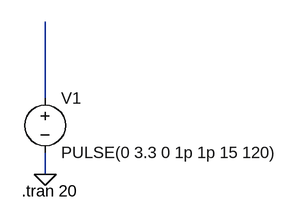
[diagram p0: schematic Draft2.asc]
Draft2.asc, the LTspice schematic file:
Version 4
SHEET 1 880 680
WIRE -192 112 -192 0
WIRE -192 224 -192 192
FLAG -192 224 0
SYMBOL voltage -192 96 R0
WINDOW 123 0 0 Left 0
WINDOW 39 0 0 Left 0
SYMATTR InstName V1
SYMATTR Value PULSE(0 3.3 0 1p 1p 15 120)
TEXT -226 248 Left 2 !.tran 20

The netlist it stands for:
* Draft2.asc
V1 N001 0 PULSE(0 3.3 0 1p 1p 15 120)
.tran 20
.backanno
.end